# Altium schematic sheet Half_Bridge_Push_Pull_Circuit.SchDoc
size 292 x 208 mm; DocumentNumber: 3; SheetNumber: 3; SheetTotal: 3
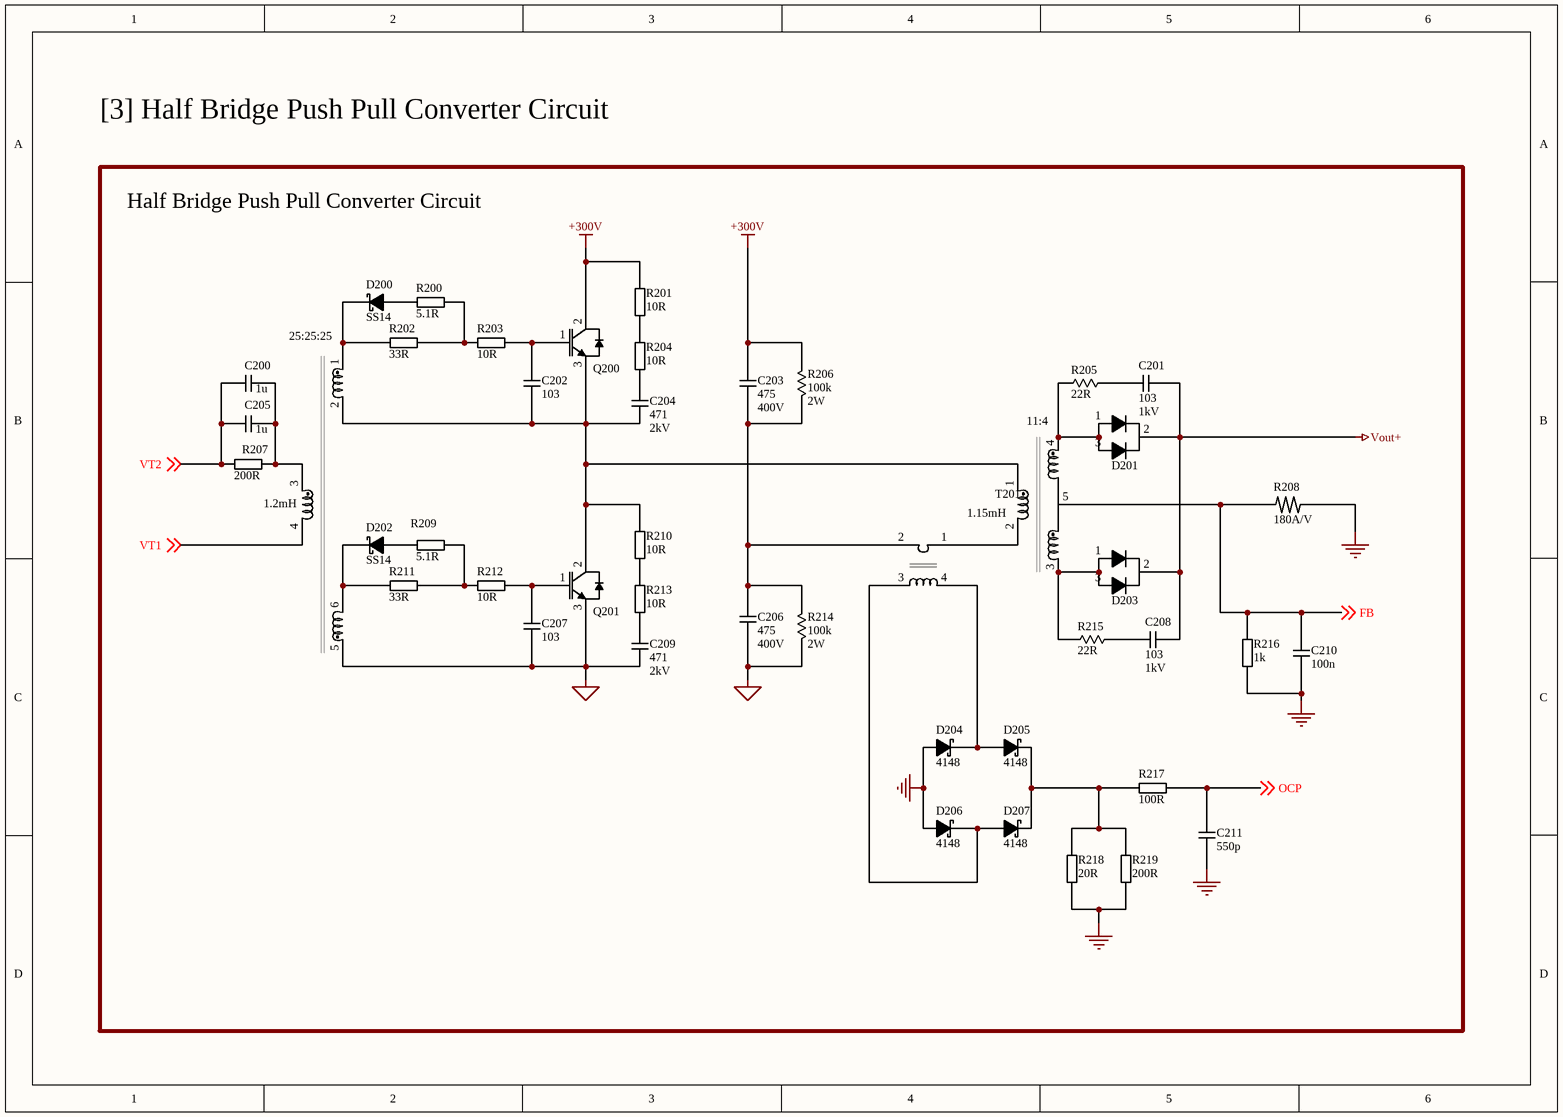
[diagram p0: Half_Bridge_Push_Pull_Circuit.SchDoc]

## Parts
C200  1u  [Cap_SMD_0805]
C201  103  Voltage: 1kV  [Cap_THD_HVCeramic_5mm]
C202  103  [Cap_THD_Ceramic_5mm]
C203  475  Voltage: 400V  [Cap_THD_Film_22.5mm]
C204  471  Voltage: 2kV  [Cap_THD_HVCeramic_5mm]
C205  1u  [Cap_SMD_0805]
C206  475  Voltage: 400V  [Cap_THD_Film_22.5mm]
C207  103  [Cap_THD_Ceramic_5mm]
C208  103  Voltage: 1kV  [Cap_THD_HVCeramic_5mm]
C209  471  Voltage: 2kV  [Cap_THD_HVCeramic_5mm]
C210  100n  [Cap_SMD_0805]
C211  550p  [Cap_SMD_0805]
D200  SS14  [Diode_SMD_4.3mm]
D201  STTH6003  [TO247 - 5.46mm]  (value not drawn)
D202  SS14  [Diode_SMD_4.3mm]
D203  STTH6003  [TO247 - 5.46mm]  (value not drawn)
D204  4148  [Diode_SMD_4.8mm]
D205  4148  [Diode_SMD_4.8mm]
D206  4148  [Diode_SMD_4.8mm]
D207  4148  [Diode_SMD_4.8mm]
Q200  IGBT_RJH60F5  [TO247 - 5.46mm]  (value not drawn)
Q201  IGBT_RJH60F5  [TO247 - 5.46mm]  (value not drawn)
R200  5.1R  [Res_SMD_1206]
R201  10R  [Res_SMD_2512]
R202  33R  [Res_SMD_1206]
R203  10R  [Res_SMD_1206]
R204  10R  [Res_SMD_2512]
R205  22R  [Res_THD_2W_17.6mm]
R206  100k  Power: 2W  [Res_THD_2W_17.6mm]
R207  200R  [Res_SMD_1206]
R208  180A/V  [Res_Shunt]
R209  5.1R  [Res_SMD_1206]
R210  10R  [Res_SMD_2512]
R211  33R  [Res_SMD_1206]
R212  10R  [Res_SMD_1206]
R213  10R  [Res_SMD_2512]
R214  100k  Power: 2W  [Res_THD_2W_17.6mm]
R215  22R  [Res_THD_2W_17.6mm]
R216  1k  [Res_SMD_0805]
R217  100R  [Res_SMD_0805]
R218  20R  [Res_SMD_2512]
R219  200R  [Res_SMD_2512]
T200  1.2mH  Turns Ratio: 25:25:25  [XFMR_BR22EEL_1178A]
T201  1.15mH  Turns Ratio: 11:4  [XFMR_T56]
T202  XFMR_E25  [XFMR_E25]  (value not drawn)

## Blocks framed on the sheet
Half Bridge Push Pull Converter Circuit: C200-C211 D200-D207 Q200 Q201 R200-R219 T200-T202

## Nets
+300V: C203.2 Q200.2(C) R201.2 R206.2
GND: C210.2 C211.2 D204.1(A) D206.1(A) R208.2 R216.2 R218.2 R219.2
GND_1: C206.1 C207.1 C209.1 Q201.3(E) R214.1 T200.5
Vout+: C201.2 C208.2 D201.2(K) D203.2(K)
FB: C210.1 R208.1 R216.1 T201.5 ; off-sheet FB
OCP: C211.1 R217.2 ; off-sheet OCP
VT1: T200.4 ; off-sheet VT1
VT2: C200.1 C205.1 R207.1 ; off-sheet VT2
NetC200_2: C200.2 C205.2 R207.2 T200.3
NetC201_1: C201.1 R205.2
NetC202_1: C202.1 C204.1 Q200.3(E) Q201.2(C) R210.2 T200.2 T201.1
NetC202_2: C202.2 Q200.1(G) R203.2
NetC203_1: C203.1 C206.2 R206.1 R214.2 T202.2
NetC204_2: C204.2 R204.1
NetC207_2: C207.2 Q201.1(G) R212.2
NetC208_1: C208.1 R215.2
NetC209_2: C209.2 R213.1
NetD200_1: D200.1(A) R200.1
NetD200_2: D200.2(K) R202.1 T200.1
NetD201_1: D201.1(A1) D201.3(A2) R205.1 T201.4
NetD202_1: D202.1(A) R209.1
NetD202_2: D202.2(K) R211.1 T200.6
NetD203_1: D203.1(A1) D203.3(A2) R215.1 T201.3
NetD204_2: D204.2(K) D205.1(A) T202.4
NetD205_2: D205.2(K) D207.2(K) R217.1 R218.1 R219.1
NetD206_2: D206.2(K) D207.1(A) T202.3
NetR200_2: R200.2 R202.2 R203.1
NetR201_1: R201.1 R204.2
NetR209_2: R209.2 R211.2 R212.1
NetR210_1: R210.1 R213.2
NetT201_2: T201.2 T202.1

## Notes on the sheet
- [3] Half Bridge Push Pull Converter Circuit

## Library data of the parts
C200 C205 = Cap_SMD_Ceramic: SMD Ceramic Capacitor
C201 C204 C208 C209 = Cap_THD_Ceramic: THD Ceramic Capacitor
C202 C207 = Cap_THD_Ceramic: THD Ceramic Capacitor; Voltage: V
C203 C206 = Cap_THD_Film: THD Film Capacitor
C210 C211 = Cap_SMD_0805: 0805 SMD Capacitor
D200 D202 = Diode_Schottky: Schottky Diode
D201 D203 = Diode_STTH6003: Diode Ultra Fast Recovery Rectifier 300V 60A 3-Pin (3+Tab) TO-247 Tube; Manufacturer: STMicroelectronics; Manufacturer Part Number: STTH6003CW; Max Reverse Current: 60uA; Reverse Recovery Time: 55ns; Peak Non-Repetitive Surge Current: 300A; Forward Voltage: 1.25V; Average Rectified Current: 30A; Supplier 1: Mouser; RoHS: Yes; Category: Rectifier Diodes; Stock 1: 6899; Pricing 1: 1=4.34, 10=3.09, 50=3.09, 100=2.69, 250=2.46, 600=2.2, 1000=2.2, 10000=2.2 (USD); Mount: Through Hole; Case/Package: TO-247; Number of Pins: 3; Min Operating Temperature: -40°C; Max Operating Temperature: 150°C; Forward Current: 60A; Max Repetitive Reverse Voltage (Vrrm): 300V; Max Surge Current: 300A; Packaging: Rail/Tube; Package Quantity: 30; Recovery Time: 55ns; Max Forward Surge Current (Ifsm): 300A; Current Rating: 60A; Voltage Rating (DC): 300V; Reverse Voltage: 300V; Max Reverse Voltage (DC): 300V; Reverse Recovery Time-Max: 55ns; Series: -; Length: 15.75mm; Width: 5.15mm; Height: 20.15mm; Radiation Hardening: No; Reach SVHC Compliant: No; Lead Free: Contains Lead; RoHS Compliant: Yes; ComponentLink1URL: https://datasheet.ciiva.com/16366/cd00001561-16366212.pdf?src-supplier=Future+Electronics; ComponentLink1Description: https://datasheet.ciiva.com/16366/cd00001561-16366212.pdf?src-supplier=Future+Electronics; ComponentLink2URL: https://datasheet.ciiva.com/15144/getdatasheetpartid-43356-15144119.pdf?src-supplier=Verical; ComponentLink2Description: https://datasheet.ciiva.com/15144/getdatasheetpartid-43356-15144119.pdf?src-supplier=Verical; ComponentLink3URL: https://datasheet.ciiva.com/4452/cd00001561-106840-4452745.pdf?src-supplier=Mouser; ComponentLink3Description: https://datasheet.ciiva.com/4452/cd00001561-106840-4452745.pdf?src-supplier=Mouser; ComponentLink4URL: https://datasheet.ciiva.com/14169/spstm-sekundargrdn-stth-6003-en-14169031.pdf?src-supplier=Distrelec; ComponentLink4Description: https://datasheet.ciiva.com/14169/spstm-sekundargrdn-stth-6003-en-14169031.pdf?src-supplier=Distrelec; Supplier Part Number 1: 511-STTH6003CW
D204-D207 = Diode_1N4148: Rectifier Diode Small Signal Switching 100V 0.2A 4ns Automotive 2-Pin DO-35 Ammo; Manufacturer: NXP Semiconductors; Manufacturer Part Number: 1N4148; Forward Current: 200mA; Capacitance: 4pF; Polarity: Standard; Max Forward Surge Current (Ifsm): 4A; Element Configuration: Single; Supplier 1: Arrow Electronics; RoHS: Yes; Category: Uncategorized; Case/Package: SOD; Number of Pins: 2; Max Operating Temperature: 200°C; Packaging: Ammo Pack; Reverse Recovery Time: 4ns; Max Repetitive Reverse Voltage (Vrrm): 100V; Current Rating: 200mA; Voltage Rating (DC): 100V; Output Current: 200mA; Current: 4A; Voltage: 100V; RoHS Compliant: Yes; Lead Free: Lead Free; Reach SVHC Compliant: No; ComponentLink1URL: https://datasheet.ciiva.com/1179/1720485-1179297.pdf?src-supplier=Element14; ComponentLink1Description: https://datasheet.ciiva.com/1179/1720485-1179297.pdf?src-supplier=Element14; ComponentLink2URL: https://datasheet.ciiva.com/26921/getdatasheetpartid-764103-26921186.pdf?src-supplier=Verical; ComponentLink2Description: https://datasheet.ciiva.com/26921/getdatasheetpartid-764103-26921186.pdf?src-supplier=Verical; Supplier Part Number 1: 1N4148
Q200 Q201 = IGBT_RJH60F5: Trans IGBT Chip N-CH 600V 80A 260400mW 3-Pin(3+Tab) TO-247A; Manufacturer: Renesas; Manufacturer Part Number: RJH60F5DPQ-A0#T0; Max Power Dissipation: 260.4W; Reverse Recovery Time: 90ns; Collector Emitter Saturation Voltage: 1.7V; Collector-emitter Voltage-Max: 1.8V; Input Type: STANDARD; Supplier 1: Digi-Key; RoHS: Yes; Category: IGBTs; Mount: Through Hole; Case/Package: TO-247-3; Number of Pins: 3; Max Operating Temperature: 150°C; Package Quantity: 1; Collector Emitter Voltage (VCEO): 600V; Packaging: Rail/Tube; Max Collector Current: 80A; Collector Emitter Breakdown Voltage: 600V; Lead Free: Lead Free; RoHS Compliant: Yes; ComponentLink1URL: https://datasheet.ciiva.com/6388/r07ds0326ej-rjh60f5dpq-6388272.pdf?src-supplier=Digi-Key; ComponentLink1Description: https://datasheet.ciiva.com/6388/r07ds0326ej-rjh60f5dpq-6388272.pdf?src-supplier=Digi-Key; Supplier Part Number 1: RJH60F5DPQ-A0#T0-ND
R200-R204 R207 R209-R213 R217-R219 = Res_SMD: SMD Resistor
R205 R215 = Res_THD: THD Resistor; Power: W
R206 R214 = Res_THD: THD Resistor
R208 = Res_Shunt: Shunt Resistor; Power: W
R216 = Res_SMD_0805: 0805 SMD Resistor
T200 = XFMR_BR22EEL_1178A: 25:25:25 Pulse Transformer; Lprimary: 1.2mH
T201 = XFMR_T56: 11:4 JiTaiXin Pulse Transformer; Lprimary: 1.15mH
T202 = XFMR_E25: 200:1 Current Transformer; Turns Ratio: 200:1